# EAGLE design untitled (EAGLE 8.3.2)
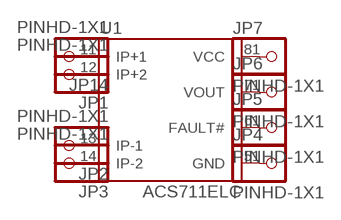
[diagram p0: schematic, sheet 1]

## Parts
JP1  PINHD-1X1  [1X01]
JP2  PINHD-1X1  [1X01]
JP3  PINHD-1X1  [1X01]
JP4  PINHD-1X1  [1X01]
JP5  PINHD-1X1  [1X01]
JP6  PINHD-1X1  [1X01]
JP7  PINHD-1X1  [1X01]
JP14  PINHD-1X1  [1X01]
U1  ACS711ELC  [SOIC8]

## Nets
N$1: JP14.1 U1.1(IP+1)
N$2: JP1.1 U1.2(IP+2)
N$3: JP2.1 U1.3(IP-1)
N$4: JP3.1 U1.4(IP-2)
N$5: JP4.1 U1.5(GND)
N$6: JP5.1 U1.6(FAULT#)
N$7: JP6.1 U1.7(VOUT)
N$8: JP7.1 U1.8(VCC)

## Library data of the parts
JP1-JP7 JP14 = !pinhead(ﾋﾟﾝﾍｯﾀﾞ):PINHD-1X1: PIN HEADER
U1 = allegro:ACS711E: SENSOR CURRENT 3.3V 8-SOIC tested: YES (etherbotix)

## Board
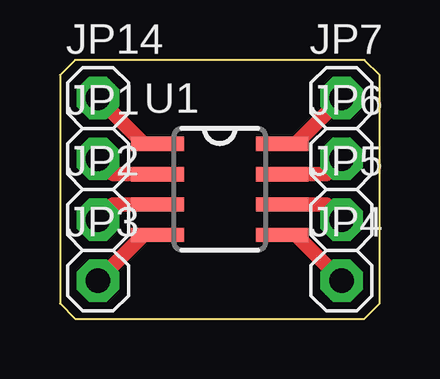
[diagram p1: board, top side]

Size 13.34 x 10.8 mm. Coordinates in mm from the lower left corner, seen from the top.
Outline: 0,10.16 0,0.64 0.64,0 12.7,0 13.34,0.64 13.34,10.16 12.7,10.8 0.64,10.8 0,10.16
Copper layers (1*16): Top 0.035mm / dielectric 1.6mm / Bottom 0.035mm
Design rules "Elecrow_2-layer_PCB_eagle_rule *": minimum track width 6mil, minimum drill 12mil, track to track 6mil, track to pad 6mil, pad to pad 6mil, via to via 8mil, smd to smd 0mil, copper to edge 20mil, drill to drill 10mil, minimum pad ring 6mil, minimum via ring 6mil, stop-mask expansion 0mil, vias tented up to drill 100mil, thermal gap 10mil

### Footprints (pad centres in the part's own frame; a part is rotated, then mirrored left to right if it is on the bottom)
1X01 = drill 1.016 pad 1.778 octagon: 1 0,0
SOIC8 = smd 0.6 x 2.2: 1 -1.905,-2.6; 2 -0.635,-2.6; 3 0.635,-2.6; 4 1.905,-2.6; 5 1.905,2.6; 6 0.635,2.6; 7 -0.635,2.6; 8 -1.905,2.6

### Placement (x,y rotation side)
JP1  1.59,6.67 0 top
JP2  1.59,4.13 0 top
JP3  1.59,1.59 0 top
JP4  11.75,1.59 0 top
JP5  11.75,4.13 0 top
JP6  11.75,6.67 0 top
JP7  11.75,9.21 0 top
JP14  1.59,9.21 0 top
U1  6.67,5.4 270 top

### Tracks (layer width: path | path; a pad name or v marks a point on that pad's centre or on a via)
N$1
  Top 0.61: U1.1 3.49,7.3 JP14.1
N$2
  Top 0.61: U1.2 2.22,6.03 JP1.1
N$3
  Top 0.61: U1.3 2.22,4.76 JP2.1
N$4
  Top 0.61: U1.4 3.49,3.49 JP3.1
N$5
  Top 0.61: U1.5 9.84,3.49 JP4.1
N$6
  Top 0.61: U1.6 11.11,4.76 JP5.1
N$7
  Top 0.61: U1.7 11.11,6.03 JP6.1
N$8
  Top 0.61: U1.8 9.84,7.3 JP7.1